# Altium schematic sheet P04.McuConfig.SchDoc
size A4
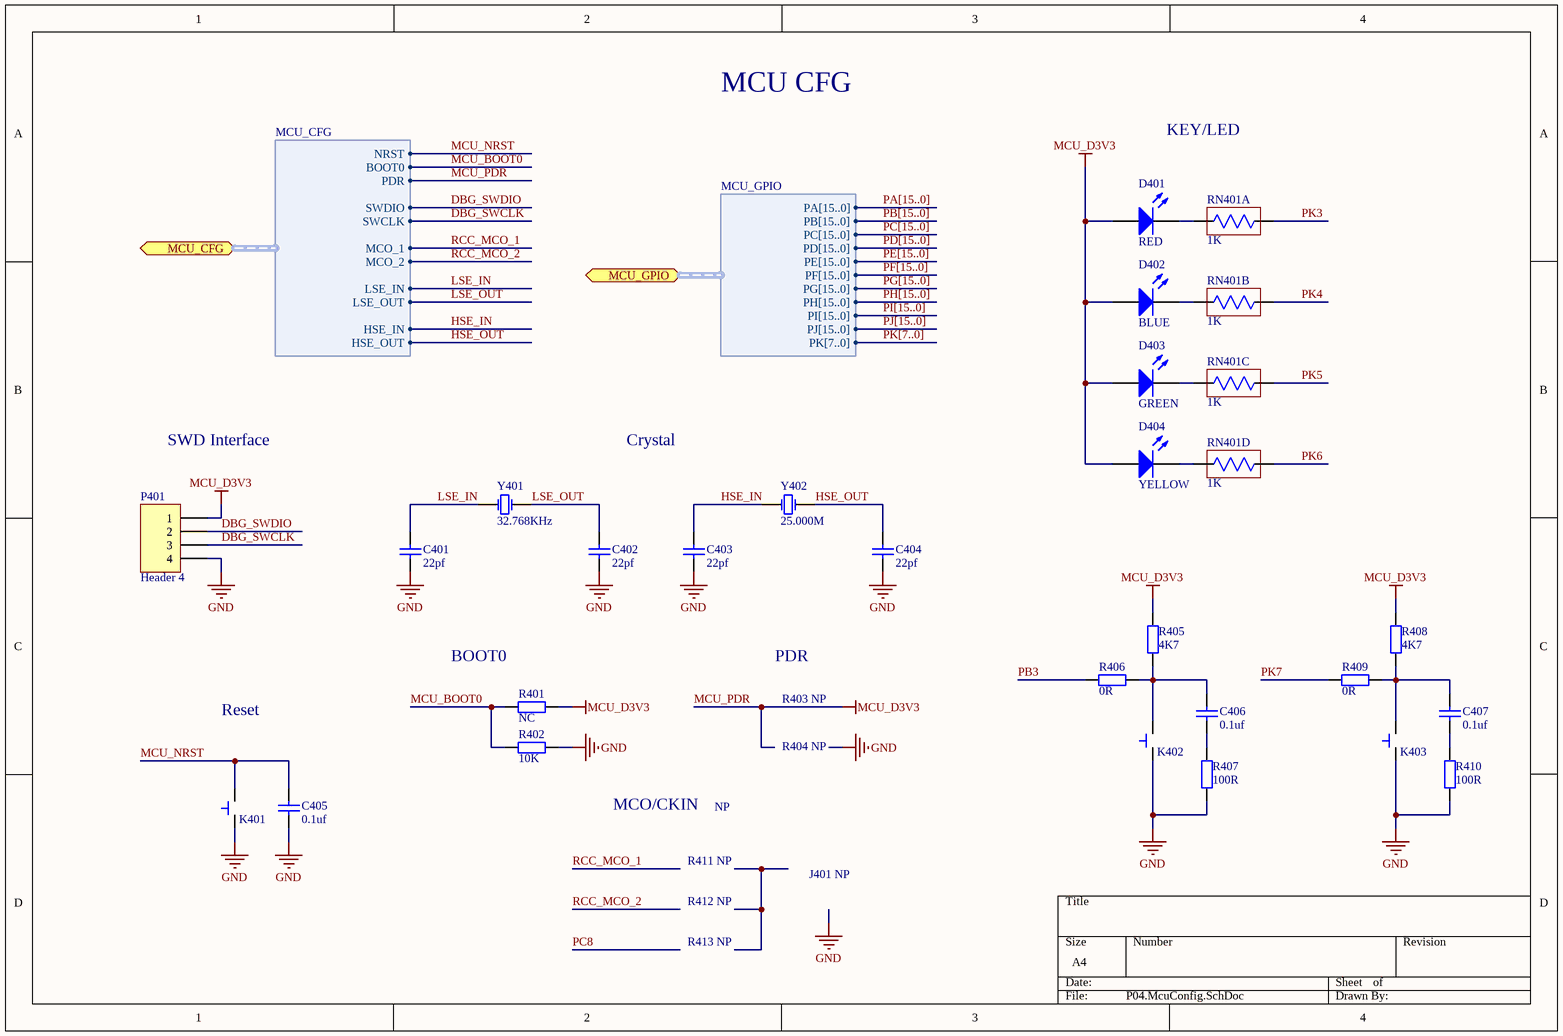
[diagram p0: P04.McuConfig.SchDoc]

## Parts
C401  value 22pf  [C0402]  (hidden comment: Cap)
C402  value 22pf  [C0402]  (hidden comment: Cap)
C403  value 22pf  [C0402]  (hidden comment: Cap)
C404  value 22pf  [C0402]  (hidden comment: Cap)
C405  value 0.1uf  [C0603]  (hidden comment: Cap)
C406  value 0.1uf  [C0603]  (hidden comment: Cap)
C407  value 0.1uf  [C0603]  (hidden comment: Cap)
D401  value RED  [LED0603]  (hidden comment: LED)
D402  value BLUE  [LED0603]  (hidden comment: LED)
D403  value GREEN  [LED0603]  (hidden comment: LED)
D404  value YELLOW  [LED0603]  (hidden comment: LED)
K401  Button  [Button-SMD-3.0x4.0x2.0]  (value not drawn)
K402  Button  [Button-SMD-3.0x4.0x2.0]  (value not drawn)
K403  Button  [Button-SMD-3.0x4.0x2.0]  (value not drawn)
P401  Header 4  [HDR1X4]
R401  value NC  [R0603]  (hidden comment: Res)
R402  value 10K  [R0603]  (hidden comment: Res)
R405  value 4K7  [R0603]  (hidden comment: Res)
R406  value 0R  [R0603]  (hidden comment: Res)
R407  value 100R  [R0603]  (hidden comment: Res)
R408  value 4K7  [R0603]  (hidden comment: Res)
R409  value 0R  [R0603]  (hidden comment: Res)
R410  value 100R  [R0603]  (hidden comment: Res)
RN401  value 1K  [RA0603]  (hidden comment: Res Array)  (parts A,B,C,D of 4)
Y401  value 32.768KHz  [XTAL-3215]  (hidden comment: XTAL)
Y402  value 25.000M  [XTAL-3225]  (hidden comment: XTAL)

## Ports
MCU_CFG (bidir, harness MCU_CFG), MCU_GPIO (bidir, harness MCU_GPIO)

## Harnesses
MCU_CFG: NRST, BOOT0, PDR, SWDIO, SWCLK, MCO_1, MCO_2, LSE_IN, LSE_OUT, HSE_IN, HSE_OUT
MCU_GPIO: PA[15..0], PB[15..0], PC[15..0], PD[15..0], PE[15..0], PF[15..0], PG[15..0], PH[15..0], PI[15..0], PJ[15..0], PK[7..0]

## Nets
GND: C401.1 C402.1 C403.1 C404.1 C405.1 K401.1(IN) K402.1(IN) K403.1(IN) P401.4 R402.2 R407.1 R410.1
MCU_PDR: D401.1(A) D402.1(A) D403.1(A) D404.1(A) P401.1 R401.2 R405.2 R408.2 ; port MCU_CFG.PDR  [also labelled MCU_D3V3]
DBG_SWCLK: P401.3 ; port MCU_CFG.SWCLK
DBG_SWDIO: P401.2 ; port MCU_CFG.SWDIO
HSE_IN: C403.2 Y402.1(OSC1) ; port MCU_CFG.HSE_IN
HSE_OUT: C404.2 Y402.3(OSC2) ; port MCU_CFG.HSE_OUT
LSE_IN: C401.2 Y401.1(OSC1) ; port MCU_CFG.LSE_IN
LSE_OUT: C402.2 Y401.2(OSC2) ; port MCU_CFG.LSE_OUT
MCU_BOOT0: R401.1 R402.1 ; port MCU_CFG.BOOT0
MCU_NRST: C405.2 K401.2(OUT) ; port MCU_CFG.NRST
PB3: R406.1
PK3: RN401.8
PK4: RN401.7
PK5: RN401.6
PK6: RN401.5
PK7: R409.1
RCC_MCO_1: port MCU_CFG.MCO_1
RCC_MCO_2: port MCU_CFG.MCO_2
NetC406_1: C406.1 R407.2
NetC406_2: C406.2 K402.2(OUT) R405.1 R406.2
NetC407_1: C407.1 R410.2
NetC407_2: C407.2 K403.2(OUT) R408.1 R409.2
NetD401_2: D401.2(K) RN401.1
NetD402_2: D402.2(K) RN401.2
NetD403_2: D403.2(K) RN401.3
NetD404_2: D404.2(K) RN401.4

## Buses and harness runs
bus PA[15..0]
bus PB[15..0]
bus PC[15..0]
bus PD[15..0]
bus PE[15..0]
bus PF[15..0]
bus PG[15..0]
bus PH[15..0]
bus PI[15..0]
bus PJ[15..0]
bus PK[7..0]

## Notes on the sheet
- MCU CFG
- KEY/LED
- SWD Interface
- Crystal
- Reset
- (near R401) BOOT0
- PDR
- R403 NP
- R404 NP
- MCO/CKIN
- NP
- R411 NP
- R412 NP
- J401 NP
- R413 NP

## Library data of the parts
K401-K403 = Button: 微动开关
P401 = Header 4: Header, 4-Pin; LatestRevisionDate: 17-Jul-2002; LatestRevisionNote: Re-released for DXP Platform.; Publisher: Altium Limited
R401 R402 R405-R410 = Res: 电阻
RN401 = Res Array 2: 贴片排阻
Y401 = XTAL: Crystal Oscillator
Y402 = XTAL3: Crystal Oscillator